# EAGLE design PixiFlood_1_7_PTH (EAGLE 7.2.0)
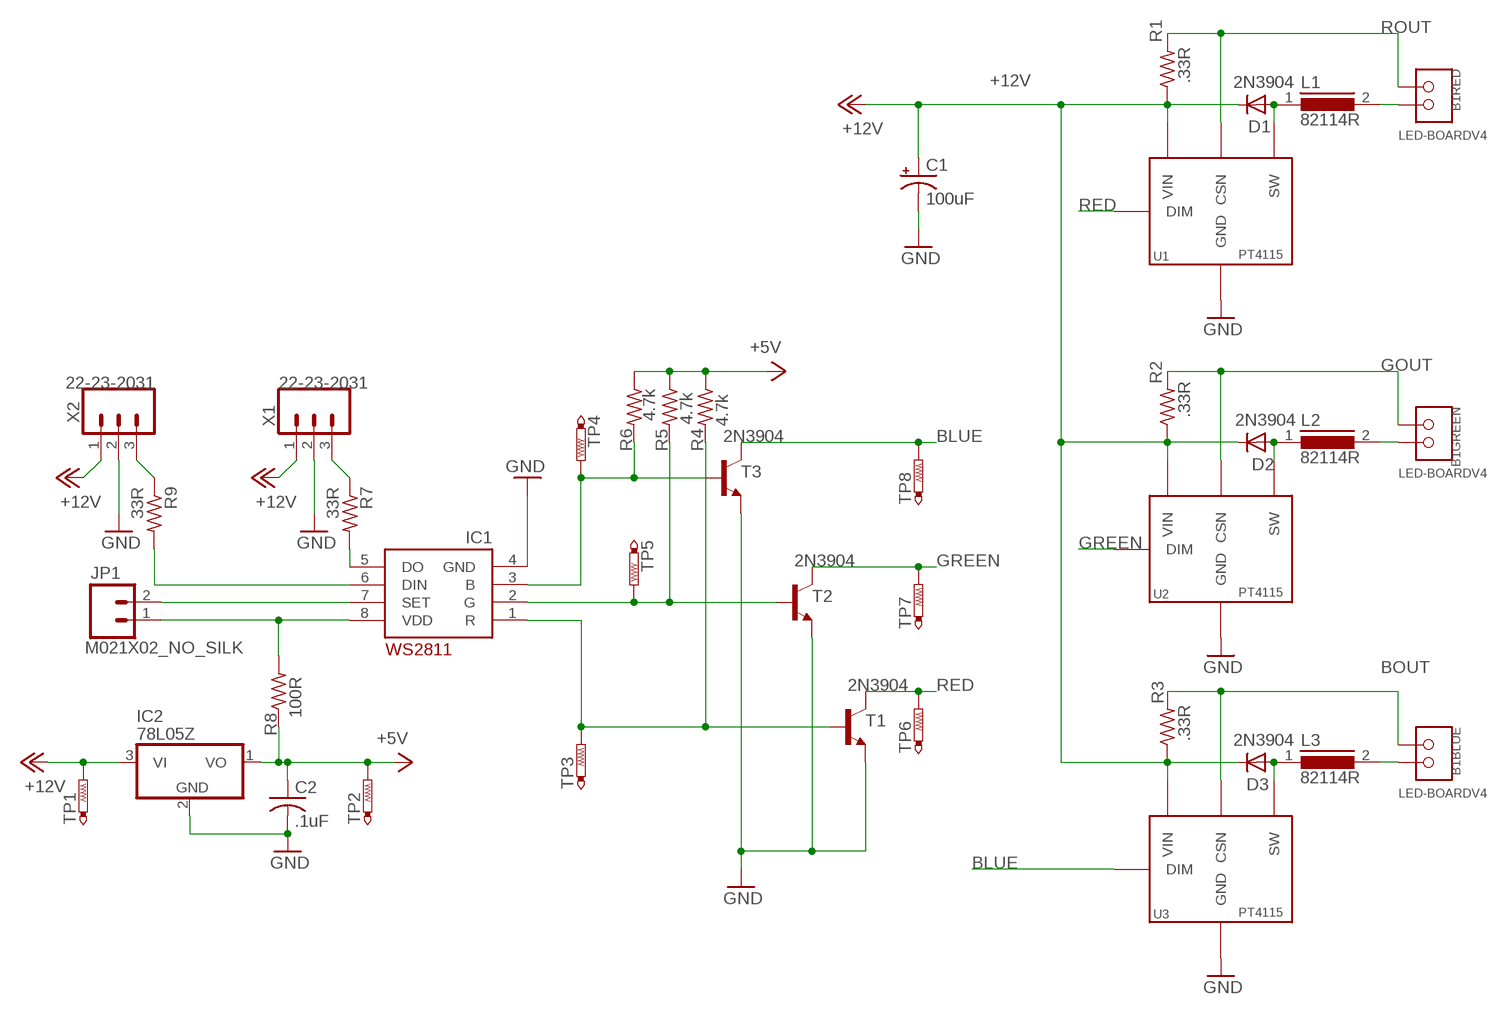
[diagram p0: schematic, sheet 1]

## Parts
B1  LED-BOARDV4  [LED_BOARD-V4]
C1  100uF  CPOL-USTT2D6L  [TT2D6L]
C2  .1uF  C-US050-024X044  [C050-024X044]
D1  2N3904  DIODE-DO07  [DO07]
D2  2N3904  DIODE-DO07  [DO07]
D3  2N3904  DIODE-DO07  [DO07]
IC1  WS2811-SOP8  [SO08-SKINNYPADS]
IC2  78L05Z  [TO92]
JP1  M021X02_NO_SILK  [1X02_NO_SILK]
L1  82114R  [82114R]
L2  82114R  [82114R]
L3  82114R  [82114R]
R1  .33R  R-US_0204/7  [0204/7]
R2  .33R  R-US_0204/7  [0204/7]
R3  .33R  R-US_0204/7  [0204/7]
R4  4.7k  R-US_0204/7  [0204/7]
R5  4.7k  R-US_0204/7  [0204/7]
R6  4.7k  R-US_0204/7  [0204/7]
R7  33R  R-US_0204/7  [0204/7]
R8  100R  R-US_0204/7  [0204/7]
R9  33R  R-US_0204/7  [0204/7]
T1  2N3904  [TO92]
T2  2N3904  [TO92]
T3  2N3904  [TO92]
TP1  PTR1B2,54  [B2,54]
TP2  PTR1B2,54  [B2,54]
TP3  PTR1B1,27  [B1,27]
TP4  PTR1B1,27  [B1,27]
TP5  PTR1B1,27  [B1,27]
TP6  PTR1B1,27  [B1,27]
TP7  PTR1B1,27  [B1,27]
TP8  PTR1B1,27  [B1,27]
U1  PT4115B89E  [SOT89-5]
U2  PT4115B89E  [SOT89-5]
U3  PT4115B89E  [SOT89-5]
X1  22-23-2031  [22-23-2031]
X2  22-23-2031  [22-23-2031]

## Nets
+5V: C2.1 IC2.1(VO) R4.1 R5.1 R6.1 R8.1 TP2.TP
+12V: C1.+ D1.C D2.C D3.C IC2.3(VI) R1.1 R2.1 R3.1 TP1.TP U1.5(VIN) U2.5(VIN) U3.5(VIN) X1.1 X2.1
BLUE: T3.1(C) TP8.TP U3.3(DIM)
BOUT: B1.B+ B1.B+@2 R3.2 U3.4(CSN)
GND: C1.- C2.2 IC1.4(GND) IC2.2(GND) T1.3(E) T2.3(E) T3.3(E) U1.2(GND) U1.2A(GND) U1.2A@1(GND) U1.2A@2(GND) U1.2A@3(GND) U1.2A@4(GND) U2.2(GND) U2.2A(GND) U2.2A@1(GND) U2.2A@2(GND) U2.2A@3(GND) U2.2A@4(GND) U3.2(GND) U3.2A(GND) U3.2A@1(GND) U3.2A@2(GND) U3.2A@3(GND) U3.2A@4(GND) X1.2 X2.2
GOUT: B1.G+ B1.G+@1 R2.2 U2.4(CSN)
GREEN: T2.1(C) TP7.TP U2.3(DIM)
N$1: D1.A L1.1 U1.1(SW)
N$2: D3.A L3.1 U3.1(SW)
N$3: B1.R- B1.R-@1 L1.2
N$4: R7.1 X1.3
N$5: D2.A L2.1 U2.1(SW)
N$6: R9.1 X2.3
N$7: IC1.5(DO) R7.2
N$8: IC1.6(DIN) R9.2
N$9: B1.G- B1.G-@1 L2.2
N$10: B1.B- B1.B-@1 L3.2
N$15: IC1.3(B) R6.2 T3.2(B) TP4.TP
N$16: IC1.7(SET) JP1.2
N$18: IC1.2(G) R5.2 T2.2(B) TP5.TP
N$20: IC1.1(R) R4.2 T1.2(B) TP3.TP
RED: T1.1(C) TP6.TP U1.3(DIM)
ROUT: B1.R+ B1.R+@1 R1.2 U1.4(CSN)
VDD: IC1.8(VDD) JP1.1 R8.2

## Library data of the parts
B1 = special:LED-BOARD
C1 = rcl:CPOL-US: POLARIZED CAPACITOR, American symbol
C2 = rcl:C-US: CAPACITOR, American symbol
D1-D3 = diode:DIODE-: DIODE
IC1 = MyLibrary:WS2811
IC2 = linear:78*: Positive VOLTAGE REGULATOR Source: http://cache.national.com/ds/LM/LM78L05.pdf http://www.fairchildsemi.com/ds/LM/LM7805.pdf
JP1 = SparkFun-Connectors:M02: Standard 2-pin 0.1" header. Use with - straight break away headers ( PRT-00116) - right angle break away headers (PRT-00553) - swiss pins (PRT-00743) - machine pins (PRT-00117) - female headers (PRT-00115) Molex polarized connector foot print use with: PRT-08233 with associated crimp pins and housings. 2.54_SCREWTERM for use with PRT-10571. 3.5mm Screw Terminal footprints for PRT-08084 5mm Screw Terminal footprints for use with PRT-08432
L1-L3 = inductors:82114R: INDUCTOR
R1-R6 = resistor:R-US_: RESISTOR, American symbol
R7-R9 = rcl:R-US_: RESISTOR, American symbol
T1-T3 = transistor:2N3904: NPN TRANSISTOR
TP1-TP8 = testpad:PTR1: TEST PIN
U1-U3 = drivers:PT4115: 30V, 1.2A Step-down High Brightness LED Driver with 5000:1 Dimming PDF: http://www.google.pl/url?sa=t&rct=j&q=PT4115&source=web&cd=1&ved=0CC4QFjAA&url=http%3A%2F%2Fwww.micro-bridge.com%2Fdata%2FCRpowtech%2FPT4115E.pdf&ei=9NbxUKXPJNSzhAem2oGoAQ&usg=AFQjCNEsPWIIWjIVjxpF5YN6SPR3coTTpw&bvm=bv.1357700187,d.d2k
X1 X2 = MyLibrary:22-23-2031: .100" (2.54mm) Center Header - 3 Pin; MF: MOLEX; MPN: 22-23-2031; OC_FARNELL: 1462950; OC_NEWARK: 30C0862

## Board
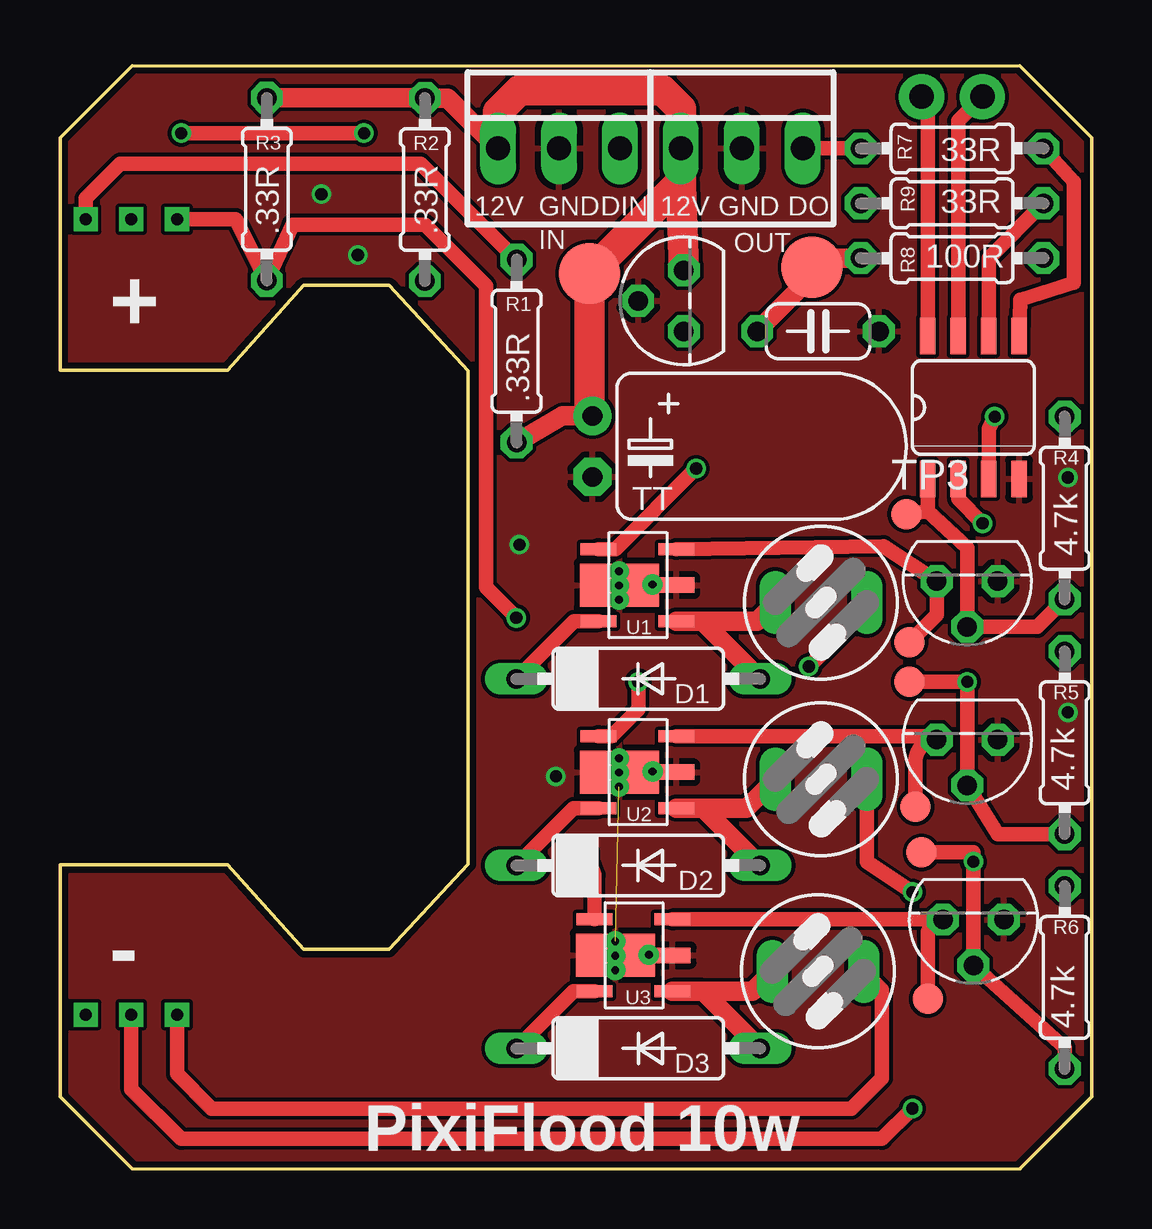
[diagram p1: board, top side]
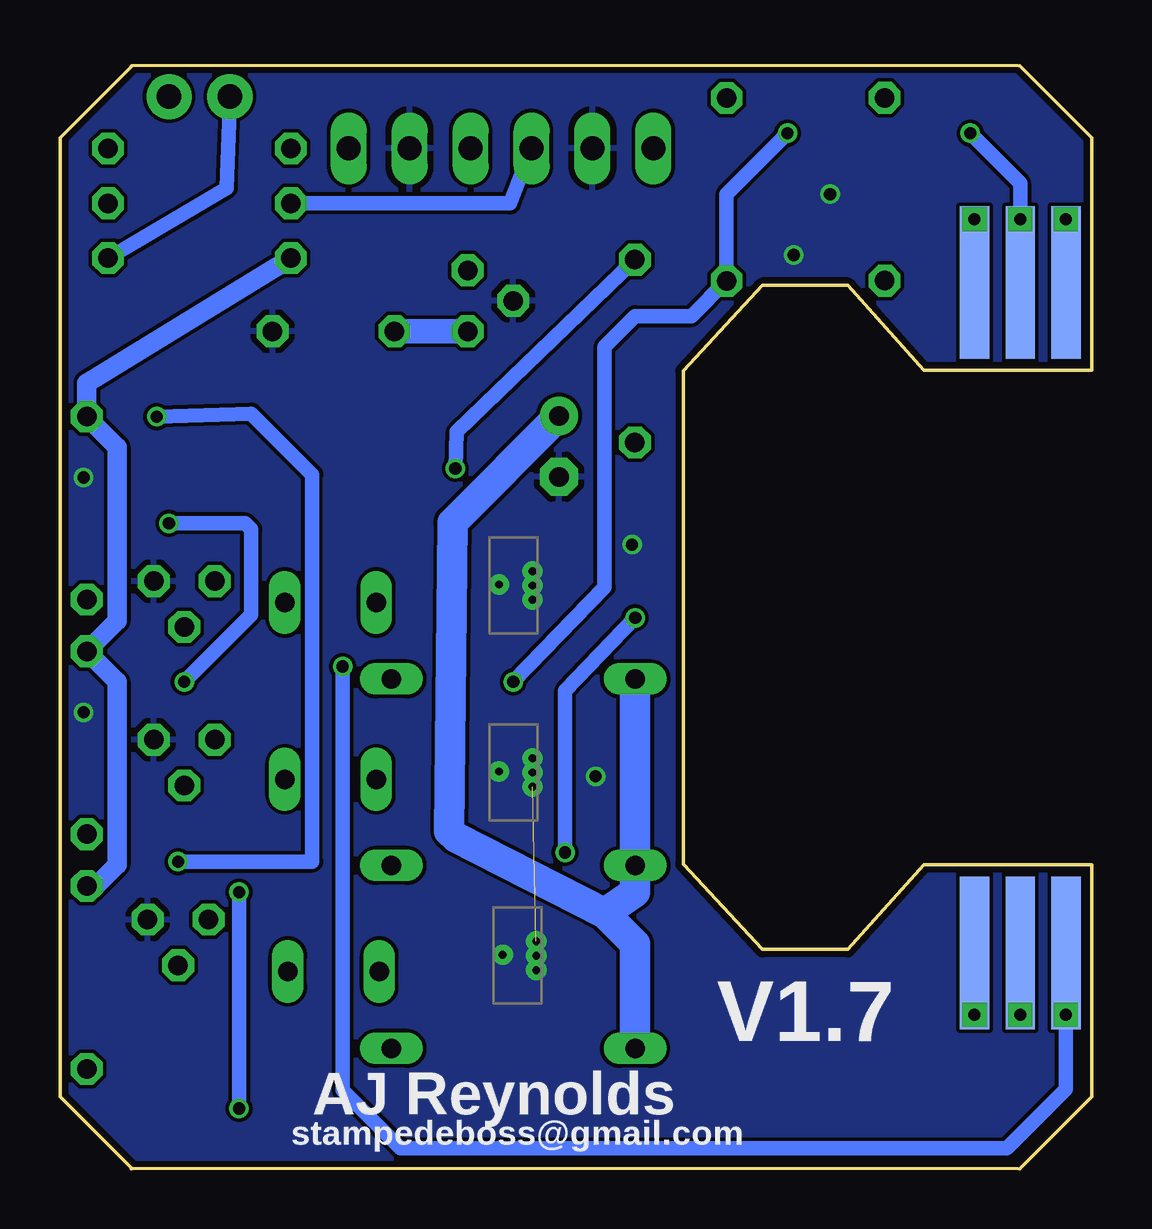
[diagram p2: board, bottom side, seen from below]

Size 43 x 45.96 mm. Coordinates in mm from the lower left corner, seen from the top.
Copper layers (1*16): Top 0.035mm / dielectric 1.5mm / Bottom 0.035mm
Design rules "Elecrow_2-layer_eagle_rule": minimum track width 6mil, minimum drill 12mil, track to track 6mil, track to pad 6mil, pad to pad 6mil, via to via 6mil, smd to smd 0mil, copper to edge 10mil, drill to drill 10mil, minimum pad ring 10mil, minimum via ring 6mil, stop-mask expansion 2mil, vias tented up to drill 100mil, thermal gap 10mil

### Footprints (pad centres in the part's own frame; a part is rotated, then mirrored left to right if it is on the bottom)
LED_BOARD-V4 = smd 1.219 x 6.35 bottom: B+ 4.902,36.957; B- 4.902,9.017; G+ 2.997,36.957; G- 2.997,9.017; R+ 1.092,36.957; R- 1.092,9.017 | drill 0.5 square: B+@2 4.902,39.599; B-@1 4.902,6.452; G+@1 2.997,39.599; G-@1 2.997,6.452; R+@1 1.092,39.599; R-@1 1.092,6.452
TT2D6L = drill 0.813 pad 1.6: + -1.27,0 | drill 0.813 pad 1.6 octagon: - 1.27,0
C050-024X044 = drill 0.813 octagon: 1 -2.54,0; 2 2.54,0
DO07 = drill 0.813 long: A 5.08,0; C -5.08,0
SO08-SKINNYPADS = smd 0.66 x 1.524: 1 -1.905,-2.973; 2 -0.635,-2.973; 3 0.635,-2.973; 4 1.905,-2.973; 5 1.905,2.973; 6 0.635,2.973; 7 -0.635,2.973; 8 -1.905,2.973
TO92 = drill 0.813 octagon: 1 -1.27,0; 2 0,1.905; 3 1.27,0
1X02_NO_SILK = drill 1.016 pad 1.88: 1 0,0; 2 2.54,0
82114R = drill 0.813 long: 1 0,1.905; 2 0,-1.905
0204/7 = drill 0.813 octagon: 1 -3.81,0; 2 3.81,0
TO92' = drill 0.813 octagon: 1 1.27,0; 2 0,1.905; 3 -1.27,0
B2,54 = smd 2.54 x 2.54: TP 0,0
B1,27 = smd 1.27 x 1.27: TP 0,0
SOT89-5 = smd 0.5 x 1.5: 1 -1.587,-1.587; 3 1.413,-1.587; 4 1.413,1.663; 5 -1.587,1.663 | smd 0.65 x 1.5: 2 -0.087,-1.587 | smd 1.8 x 3.3: 2A -0.087,0.787 | drill 0.33 pad 0.33: 2A@1 -0.7,0.8; 2A@2 -0.1,0.8; 2A@3 0.5,0.8; 2A@4 -0.059,-0.597
22-23-2031 = drill 1 long: 1 -2.54,0; 2 0,0; 3 2.54,0

### Placement (x,y rotation side)
B1  -0.03,-0.03 0 top
C1  22.2,30.11 270 top
C2  31.6,34.9 0 top
D1  24.1,20.42 0 top
D2  24.1,12.64 0 top
D3  24.11,5.02 0 top
IC1  38.07,31.72 0 top
IC2  26.01,36.17 90 top
JP1  35.92,44.68 0 top
L1  31.72,23.6 90 top
L2  31.72,16.23 90 top
L3  31.6,8.23 90 top
R1  19.04,34.07 90 top
R2  15.21,40.81 270 top
R3  8.62,40.82 270 top
R4  41.88,27.53 270 top
R5  41.88,17.75 270 top
R6  41.88,7.98 270 top
R7  37.19,42.52 0 top
R8  37.19,37.95 0 top
R9  37.19,40.23 0 top
T1  2N3904  [TO92']  37.82,24.49 180 top
T2  2N3904  [TO92']  37.82,17.88 180 top
T3  2N3904  [TO92']  38.07,10.39 180 top
TP1  22.07,37.31 0 top
TP2  31.34,37.57 0 top
TP3  35.28,27.28 0 top
TP4  35.92,13.18 0 top
TP5  35.41,20.29 0 top
TP6  35.41,21.95 0 top
TP7  35.66,15.09 0 top
TP8  36.17,7.09 0 top
U1  24.1,24.41 90 top
U2  24.11,16.62 90 top
U3  23.95,8.98 90 top
X1  28.42,42.52 0 top
X2  20.8,42.52 0 top

### Tracks (layer width: path | path; a pad name or v marks a point on that pad's centre or on a via)
+5V
  Top 0.813: C2.1 31.34,37.19 TP2.TP 31.72,37.95 R8.1
  Bottom 0.813: R8.1 41.88,32.74 R4.1 40.61,30.07 40.61,22.83 R5.1 40.61,20.29 40.61,12.67 41.5,11.79 R6.1
  Bottom 1.016: IC2.1 C2.1
+12V
  Top 0.61: D2.C 21.41,15.03 U2.5 | D3.C 21.4,7.4 U3.5 | D1.C 21.42,22.82 U1.5
  Top 0.813: R3.1 15.2,44.63 R2.1 16.17,44.62 X2.1 | R1.1 20.95,31.38 C1.+
  Top 1.27: 25.88,41.12 25.88,41 IC2.3 | D3.C | X2.1 18.26,44.04 19.15,44.93 25.12,44.93 25.88,44.17 X1.1 25.88,41.88 25.88,41.12 | C1.+ 22.07,31.5 TP1.TP 25.88,41.12
  Bottom 1.27: C1.+ 26.64,26.93 26.77,14.07 26.52,13.82 20.29,10.64 | 20.29,10.64 19.02,11.53 D2.C D1.C | 20.29,10.64 19.03,9.37 D3.C
BLUE
  Top 0.61: U3.3 36.8,10.4 T3.1 arc90 36.17,9.75 TP8.TP
BOUT  (via drill 0.51)
  Top 0.61: B1.B+@2 7.32,39.57 R3.2 9.69,39.34 15.21,39.34 17.75,36.8 17.75,24.23 v19.02,22.96 | U3.4 22.28,12.25 v21.95,13.18
  Bottom 0.61: B1.B+@2 B1.B+ | v21.95,13.18 21.95,19.91 v19.02,22.96
GND  (via drill 0.51)  (1 unrouted)
  other vias: 10.9,40.61 12.42,38.07 19.15,26.01 42.01,28.8 42.01,19.02 20.68,16.36
  pour Bottom: -0.03,-0.03 43.15,-0.03 43.15,46.2 -0.03,46.2
  pour Top: -0.03,-0.03 43.15,-0.03 43.15,46.2 -0.03,46.2
GOUT  (via drill 0.51)
  Top 0.61: v12.67,43.15 v5.05,43.15 | U2.4 22.98,18.03 24.1,19.15 v24.1,20.29
  Bottom 0.61: v12.67,43.15 15.21,40.62 R2.2 16.67,35.53 19.02,35.53 20.29,34.26 20.29,24.23 v24.1,20.29 | v5.05,43.15 2.97,41.07 B1.G+@1 B1.G+
GREEN
  Top 0.61: U2.3 36.4,18.03 T2.1 arc90 35.66,16.99 TP7.TP
N$1
  Top 0.813: L1.1 29.04,22.82 U1.1 26.79,22.82 D1.A
N$2
  Top 0.813: L3.1 28.86,7.4 U3.1 26.81,7.4 D3.A
N$3  (via drill 0.51)
  Top 0.61: L1.2 33.63,23.34 v31.22,20.93
  Bottom 0.61: v31.22,20.93 31.22,3.28 28.8,0.86 3.53,0.86 1.07,3.33 B1.R-@1 B1.R-
N$4
  Top 0.61: X1.3 R7.1
N$5
  Top 0.813: L2.1 28.62,15.03 U2.1 26.8,15.03 D2.A
N$6
  Bottom 0.61: X2.3 24.23,40.23 R9.1
N$7
  Top 0.61: R7.2 42.27,41.12 42.27,36.93 40.03,36.22 IC1.5
N$8
  Top 0.61: R9.2 38.71,37.95 IC1.6
N$9  (via drill 0.51)
  Top 0.61: L2.2 33.63,12.8 v35.53,11.53 | v35.53,2.51 34.26,1.24 5.05,1.24 2.97,3.33 B1.G-@1
  Bottom 0.61: B1.G- B1.G-@1 | v35.53,11.53 v35.53,2.51
N$10
  Top 0.61: L3.2 34.26,7.47 34.26,3.78 32.99,2.51 6.32,2.51 4.88,3.96 B1.B-@1
  Bottom 0.61: B1.B- B1.B-@1
N$15  (via drill 0.51)
  Top 0.61: R6.2 41.88,5.05 T3.2 v38.07,12.8 38.07,13.18 TP4.TP | v38.96,31.34 38.71,30.84 IC1.3
  Bottom 0.61: v38.07,12.8 32.49,12.8 32.49,28.93 35.03,31.47 v38.96,31.34
N$16
  Top 0.61: JP1.2 37.44,43.66 IC1.7
N$18  (via drill 0.51)
  Top 0.61: R5.2 39.09,13.94 T2.2 v37.82,20.29 TP5.TP | IC1.2 37.44,27.91 v38.46,26.9
  Bottom 0.61: v37.82,20.29 35.03,23.09 35.03,26.64 35.28,26.9 v38.46,26.9
N$20
  Top 0.61: 36.17,27.41 37.82,25.88 T1.2 40.74,22.58 R4.2 | 36.17,27.41 IC1.1 | TP3.TP 36.17,27.41
RED
  Top 0.61: U1.3 34.33,25.95 T1.1 36.55,23.09 TP6.TP
ROUT  (via drill 0.51)
  Top 0.61: R1.2 15.03,41.88 2.51,41.88 1.07,40.44 B1.R+@1 | U1.4 23.15,25.82 v26.52,29.18
  Bottom 0.61: B1.R+ B1.R+@1 | v26.52,29.18 26.46,30.71 R1.2
VDD
  Top 0.61: JP1.1 36.17,44.42 IC1.8
  Bottom 0.61: R8.2 36.04,40.87 JP1.1

### Text on the board
tPlace: 12V | GND | DIN | 12V | GND | DO | IN | OUT | PixiFlood 10w
bPlace: V1.7 | AJ Reynolds | stampedeboss@gmail.com